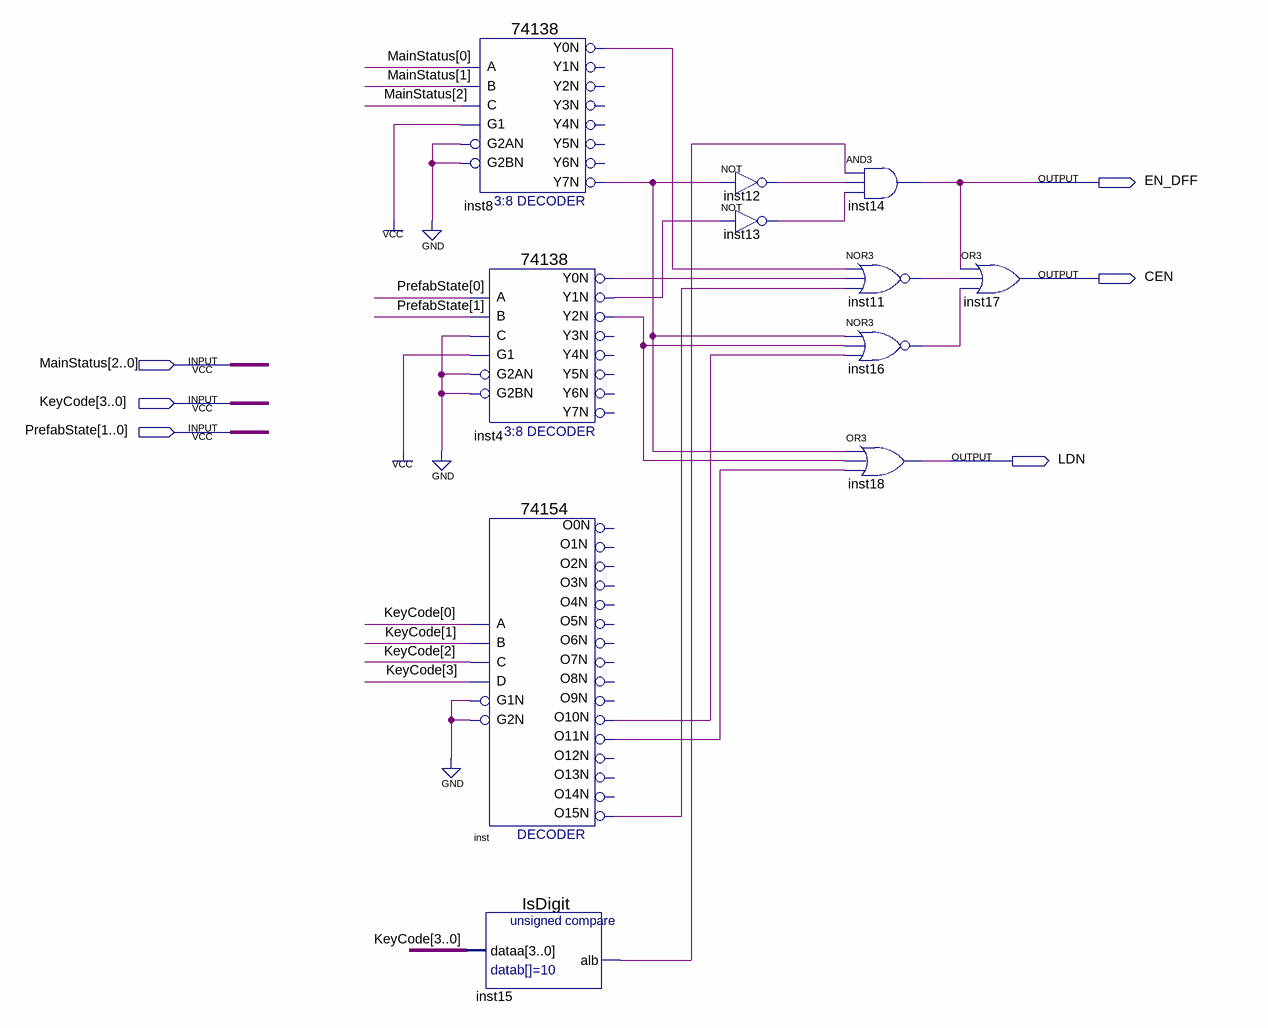
[diagram p0: schematic sheet]
// Quartus schematic PrefabStatusJudge.bdf as structural Verilog: 11 symbols, 6 pins
module PrefabStatusJudge (
  input  [2:0] MainStatus,
  input  [3:0] KeyCode,
  input  [1:0] PrefabState,
  output EN_DFF,
  output CEN,
  output LDN
);

  wire inst4_y0n, inst4_y1n, inst4_y2n, inst8_y0n, inst8_y7n, inst11_out, inst12_out, inst13_out, inst15_alb,
       inst16_out, inst_o10n, inst_o11n, inst_o15n;

  \74138  inst8 (
    .A(MainStatus[0]), .B(MainStatus[1]), .G1(1'b1), .C(MainStatus[2]), .G2AN(1'b0), .G2BN(1'b0),
    .Y0N(inst8_y0n), .Y7N(inst8_y7n));  // open: Y1N, Y2N, Y3N, Y4N, Y5N, Y6N
  \74138  inst4 (
    .A(PrefabState[0]), .B(PrefabState[1]), .G1(1'b1), .C(1'b0), .G2AN(1'b0), .G2BN(1'b0), .Y0N(inst4_y0n),
    .Y1N(inst4_y1n), .Y2N(inst4_y2n));  // open: Y3N, Y4N, Y5N, Y6N, Y7N
  \74154  inst (
    .C(KeyCode[2]), .D(KeyCode[3]), .B(KeyCode[1]), .A(KeyCode[0]), .G1N(1'b0), .G2N(1'b0), .O15N(inst_o15n),
    .O10N(inst_o10n), .O11N(inst_o11n));  // open: O0N, O12N, O1N, O13N, O14N, O4N, O3N, O2N, O7N, O6N, O5N, O9N, O8N
  IsDigit inst15 (.dataa(KeyCode), .alb(inst15_alb));
  not inst12 (inst12_out, inst8_y7n);
  not inst13 (inst13_out, inst4_y1n);
  and inst14 (EN_DFF, inst15_alb, inst12_out, inst13_out);
  nor inst11 (inst11_out, inst8_y0n, inst4_y0n, inst_o15n);
  nor inst16 (inst16_out, inst8_y7n, inst4_y2n, inst_o10n);
  or inst18 (LDN, inst8_y7n, inst4_y2n, inst_o11n);
  or inst17 (CEN, EN_DFF, inst11_out, inst16_out);
endmodule
